# Altium project BodyCaINseedv0.2.PrjPcb
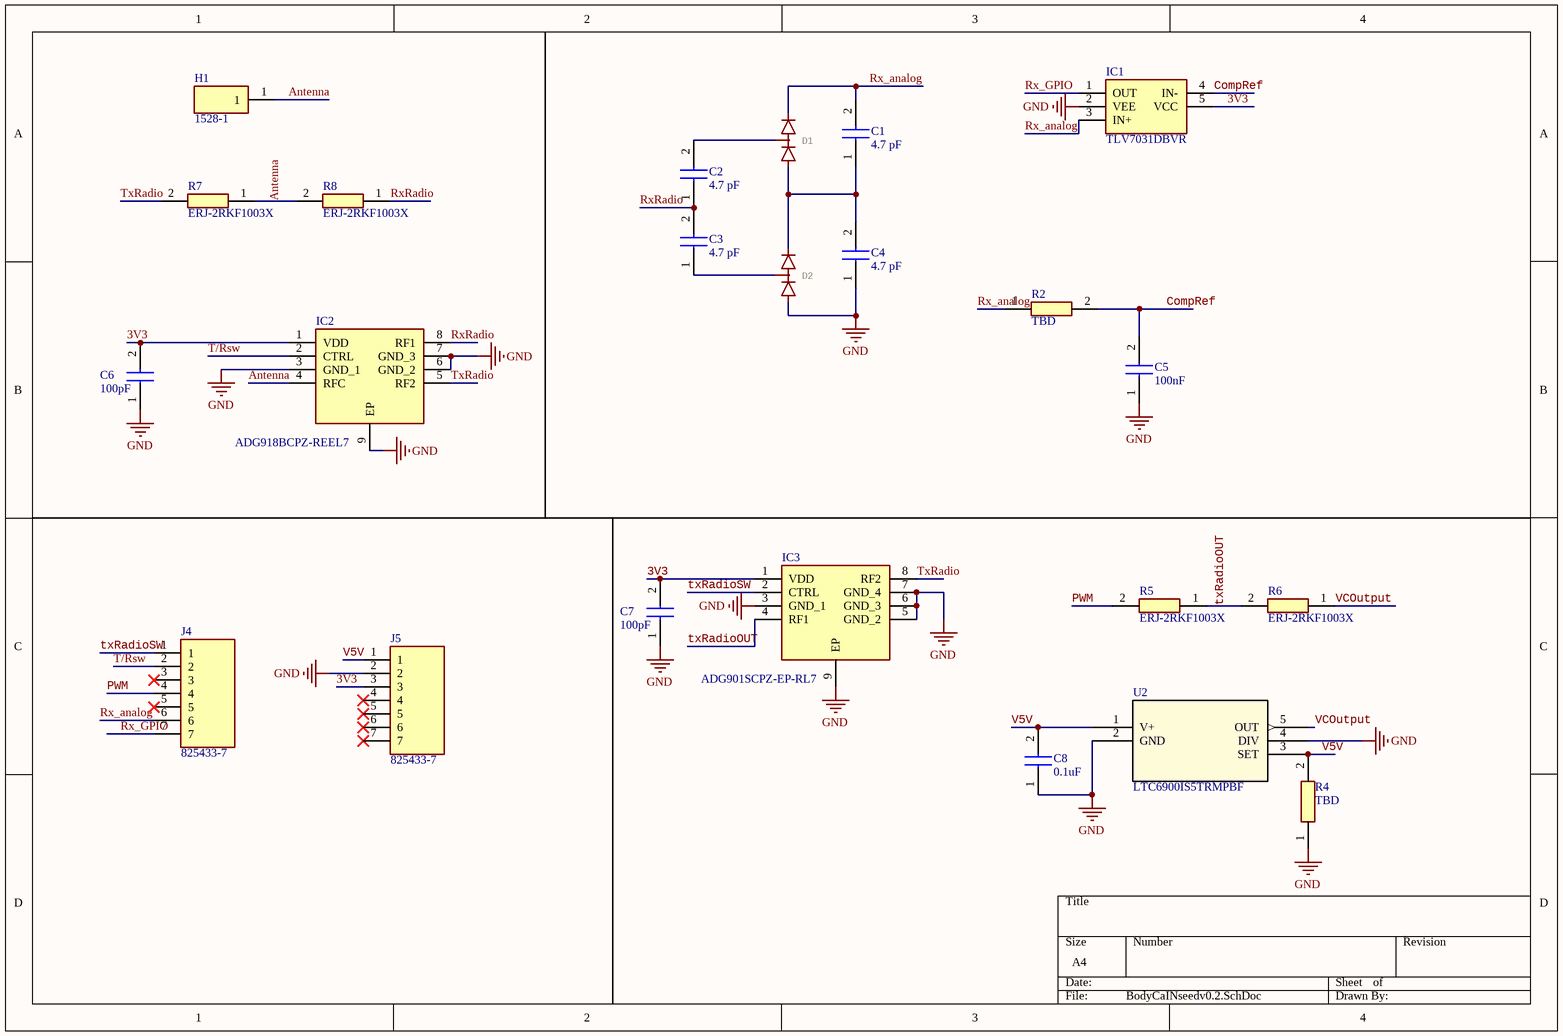
[diagram p0: BodyCaINseedv0.2.SchDoc]
1 sheet, 23 parts. Net scope: global (net labels, ports and power ports of the same name join across sheets).
Board file: BodyCaINseedv0.2.PcbDoc

## Sheet BodyCaINseedv0.2.SchDoc
size A4; SheetNumber: 1; SheetTotal: 1

### Parts
C1  4.7 pF  [CAPC1608X73N]
C2  4.7 pF  [CAPC1608X73N]
C3  4.7 pF  [CAPC1608X73N]
C4  4.7 pF  [CAPC1608X73N]
C5  100nF  [CAPC1608X90N]
C6  100pF  [CAPC1608X97N]
C7  100pF  [CAPC1608X97N]
C8  0.1uF  [CAPC1608X100N]
D1  RB706F-40FHT106  [SOT23]  (value not drawn)
D2  RB706F-40FHT106  [SOT23]  (value not drawn)
H1  1528-1  [15281]
IC1  TLV7031DBVR  [SOT95P280X145-5N]
IC2  ADG918BCPZ-REEL7  [SON50P300X300X85-9N-D]
IC3  ADG901SCPZ-EP-RL7  [SON50P300X300X85-9N-D]
J4  825433-7  [1725708]
J5  825433-7  [1725708]
R2  TBD  [RESC1508X46N]
R4  TBD  [RESC1508X46N]
R5  ERJ-2RKF1003X  [ERJ2RKD1004X]
R6  ERJ-2RKF1003X  [ERJ2RKD1004X]
R7  ERJ-2RKF1003X  [ERJ2RKD1004X]
R8  ERJ-2RKF1003X  [ERJ2RKD1004X]
U2  LTC6900IS5TRMPBF  [S_5_ADI]

### Nets
GND: C4.1 C5.1 C6.1 C7.1 C8.1 D2.1(A) IC1.2(VEE) IC2.3(GND_1) IC2.6(GND_2) IC2.7(GND_3) IC2.9(EP) IC3.3(GND_1) IC3.5(GND_2) IC3.6(GND_3) IC3.7(GND_4) IC3.9(EP) J5.2 R4.1 U2.2(GND) U2.4(DIV)
3V3: C6.2 C7.2 IC1.5(VCC) IC2.1(VDD) IC3.1(VDD) J5.3
Antenna: H1.1 IC2.4(RFC) R7.1 R8.2
CompRef: C5.2 IC1.4(IN-) R2.2
PWM: J4.4 R5.2
Rx_analog: C1.2 D1.2(C) IC1.3(IN+) J4.6 R2.1
Rx_GPIO: IC1.1(OUT) J4.7
RxRadio: C2.1 C3.2 IC2.8(RF1) R8.1
T/Rsw: IC2.2(CTRL) J4.2
TxRadio: IC2.5(RF2) IC3.8(RF2) R7.2
txRadioOUT: IC3.4(RF1) R5.1 R6.2
txRadioSW: IC3.2(CTRL) J4.1
V5V: C8.2 J5.1 R4.2 U2.1(V+) U2.3(SET)
VCOutput: R6.1 U2.5(OUT)
NetC1_1: C1.1 C4.2 D1.1(A) D2.2(C)
NetC2_2: C2.2 D1.3(AC)
NetC3_1: C3.1 D2.3(AC)

Not connected (* = marked no-connect by the designer): J4 3* 5*; J5 4* 5* 6* 7*

### Library data of the parts
C1-C4 = 06035J4R7BBSTR: Capacitor 06035J4R7BBSTR; Manufacturer_Name: Kyocera AVX; Datasheet Link: https://datasheets.kyocera-avx.com/Accu-P.pdf; Height: 0.73mm; Manufacturer_Part_Number: 06035J4R7BBSTR; Mouser Part Number: 581-06035J4R7BBS; Mouser Price/Stock: https://www.mouser.com/Search/Refine.aspx?Keyword=581-06035J4R7BBS; Arrow Part Number: 06035J4R7BBSTR; Arrow Price/Stock: https://www.arrow.com/en/products/06035j4r7bbstr/avx
C5 = GCM188R71H103KA37J: Capacitor GCM188R71H103KA37J; Manufacturer_Name: Murata Electronics; Datasheet Link: https://psearch.en.murata.com/capacitor/product/GCM188R71H103KA37%23.pdf; Height: 0.9mm; Manufacturer_Part_Number: GCM188R71H103KA37J; Mouser Part Number: 81-GCM188R71H103KA7J; Mouser Price/Stock: https://www.mouser.co.uk/ProductDetail/Murata-Electronics/GCM188R71H103KA37J?qs=N3Kl9KD794T3%2FxlXdF0Axg%3D%3D; Arrow Part Number: GCM188R71H103KA37J; Arrow Price/Stock: https://www.arrow.com/en/products/gcm188r71h103ka37j/murata-manufacturing?region=nac
C6 C7 = VJ0603A101FXAAC: Capacitor VJ0603A101FXAAC; Manufacturer_Name: Vishay; Datasheet Link: http://www.vishay.com/docs/45226/vj31xrohsautomlcc.pdf; Height: 0.97mm; Manufacturer_Part_Number: VJ0603A101FXAAC; Mouser Part Number: 77-VJ0603A101FXAAC; Mouser Price/Stock: https://www.mouser.co.uk/ProductDetail/Vishay-Vitramon/VJ0603A101FXAAC?qs=S65kAjFE%2FJCNoIVW2knBSg%3D%3D; Arrow Part Number: VJ0603A101FXAAC; Arrow Price/Stock: https://www.arrow.com/en/products/vj0603a101fxaac/vishay?region=nac
C8 = C0603X104K1RACTU: CapacitorC0603X104K1RACTU; Manufacturer_Name: KEMET; Datasheet Link: https://search.kemet.com/component-documentation/download/specsheet/C0603X104K1RACTU; Height: 1mm; Manufacturer_Part_Number: C0603X104K1RACTU
D1 D2 = DIODE_2CACA-SOT23: 2 Diodes - Cathode-Anode|Cathode-Anode DIODE_2CACA-SOT23; GateName_1: -B1; SymbolName_1: KA2KA; POPULARITY: 1; DeviceName: SOT23; LibraryName: diode; DeviceSetName: DIODE_2CACA-
H1 = 1528-1: Hardware; Manufacturer_Name: Keystone Electronics; Datasheet Link: https://www.keyelco.com/product-pdf.cfm?p=3317; Height: 2.51mm; Manufacturer_Part_Number: 1528-1; Mouser Part Number: 534-1528-1; Mouser Price/Stock: https://www.mouser.com/Search/Refine.aspx?Keyword=534-1528-1
IC1 = TLV7031DBVR: Integrated Circuit; Manufacturer_Name: Texas Instruments; Datasheet Link: http://www.ti.com/lit/gpn/TLV7031; Height: 1.45mm; Manufacturer_Part_Number: TLV7031DBVR; Mouser Part Number: 595-TLV7031DBVR; Mouser Price/Stock: https://www.mouser.co.uk/ProductDetail/Texas-Instruments/TLV7031DBVR?qs=EBDBlbfErPzxbC0zg598sw%3D%3D; Arrow Part Number: TLV7031DBVR; Arrow Price/Stock: https://www.arrow.com/en/products/tlv7031dbvr/texas-instruments?region=nac
IC2 = ADG918BCPZ-REEL7: Integrated Circuit; Manufacturer_Name: Analog Devices; Datasheet Link: http://www.analog.com/media/en/technical-documentation/data-sheets/ADG918_919.pdf; Height: 0.85mm; Manufacturer_Part_Number: ADG918BCPZ-REEL7; Mouser Part Number: 584-ADG918BCPZ-R7; Mouser Price/Stock: https://www.mouser.co.uk/ProductDetail/Analog-Devices/ADG918BCPZ-REEL7?qs=BpaRKvA4VqEK8oT2sWj1IQ%3D%3D; Arrow Part Number: ADG918BCPZ-REEL7; Arrow Price/Stock: https://www.arrow.com/en/products/adg918bcpz-reel7/analog-devices?region=nac
IC3 = ADG901SCPZ-EP-RL7: Integrated Circuit; Manufacturer_Name: Analog Devices; Datasheet Link: https://www.analog.com/media/en/technical-documentation/data-sheets/ADG901-EP.pdf; Height: 0.85mm; Manufacturer_Part_Number: ADG901SCPZ-EP-RL7; Mouser Part Number: 584-ADG901SCPZEPRL7; Mouser Price/Stock: https://www.mouser.co.uk/ProductDetail/Analog-Devices/ADG901SCPZ-EP-RL7?qs=S8zVn2bBIh8DlciUwzRt2A%3D%3D; Arrow Part Number: ADG901SCPZ-EP-RL7; Arrow Price/Stock: https://www.arrow.com/en/products/adg901scpz-ep-rl7/analog-devices?region=nac
J4 J5 = 825433-7: Connector; Manufacturer_Name: TE Connectivity; Datasheet Link: https://www.te.com/commerce/DocumentDelivery/DDEController?Action=srchrtrv&DocNm=825433&DocType=Customer+Drawing&DocLang=English&DocFormat=pdf&PartCntxt=825433-7; Height: 9.9mm; Manufacturer_Part_Number: 825433-7; Mouser Part Number: 571-825433-7; Mouser Price/Stock: https://www.mouser.co.uk/ProductDetail/TE-Connectivity/825433-7?qs=Yxch5oR%2FTsMBxkkF1vNhLA%3D%3D; Arrow Part Number: 825433-7; Arrow Price/Stock: https://www.arrow.com/en/products/825433-7/te-connectivity?region=nac
R2 R4 = WSL060300000ZEA9: Resistor WSL060300000ZEA9; Manufacturer_Name: Vishay; Datasheet Link: http://www.vishay.com/docs/30192/wsl-9.pdf; Height: 0.457mm; Manufacturer_Part_Number: WSL060300000ZEA9; Mouser Part Number: 71-WSL060300000ZEA9; Mouser Price/Stock: https://www.mouser.co.uk/ProductDetail/Vishay-Dale/WSL060300000ZEA9?qs=Q7nJoqLg%252BZgzeflh6I0jJw%3D%3D; Arrow Part Number: WSL060300000ZEA9; Arrow Price/Stock: https://www.arrow.com/en/products/wsl060300000zea9/vishay?region=nac
R5-R8 = ERJ-2RKF1003X: Resistor; Manufacturer_Name: Panasonic; Datasheet Link: https://industrial.panasonic.com/cdbs/www-data/pdf/RDA0000/AOA0000C86.pdf; Height: 0.4mm; Manufacturer_Part_Number: ERJ-2RKF1003X; Mouser Part Number: 667-ERJ-2RKF1003X; Mouser Price/Stock: https://www.mouser.co.uk/ProductDetail/Panasonic/ERJ-2RKF1003X?qs=H7k1u0Mp9JQnXoBKdf15Qg%3D%3D; Arrow Part Number: ERJ-2RKF1003X; Arrow Price/Stock: https://www.arrow.com/en/products/erj-2rkf1003x/panasonic?region=europe
U2 = LTC6900IS5TRMPBF: No Description Available; Mfr_Name: Analog Devices Inc; RefDes: RefDes; Type: Type